# EAGLE design Lowduino_Minimal (EAGLE 7.2.0)
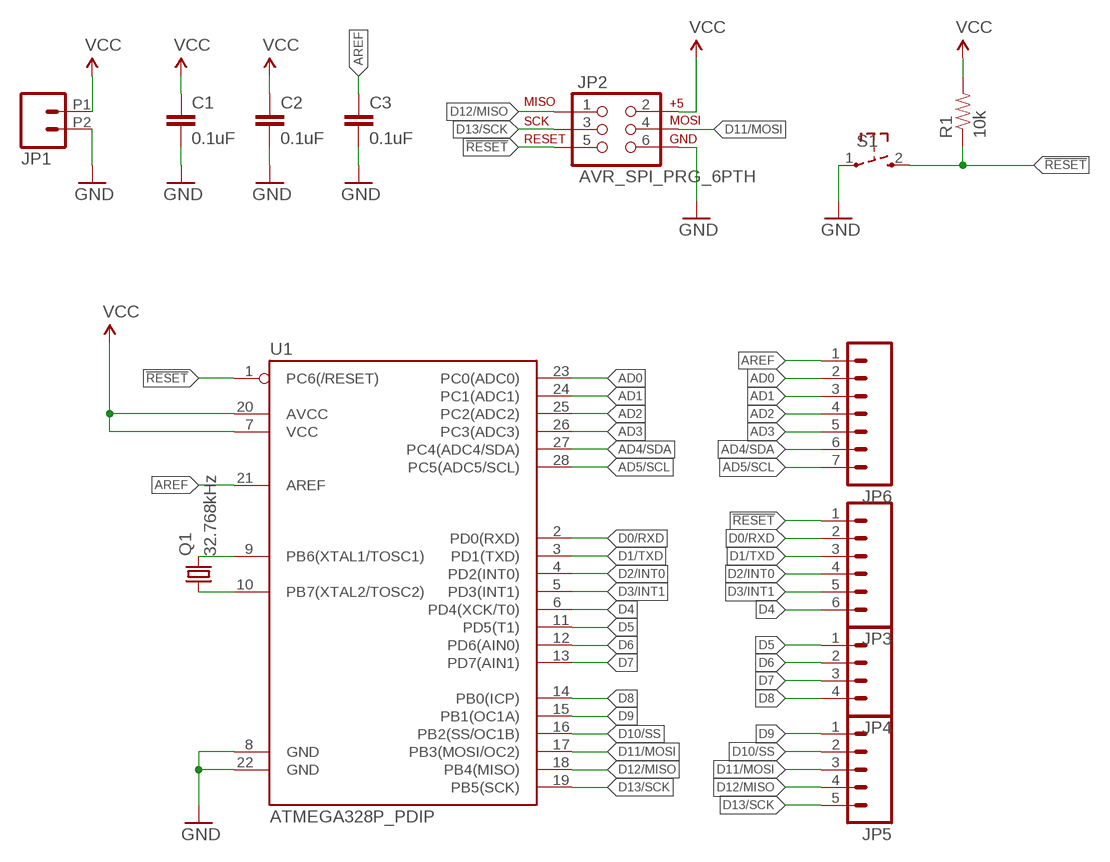
[diagram p0: schematic, sheet 1]

## Parts
C1  0.1uF  CAPPTH  [CAP-PTH-SMALL]
C2  0.1uF  CAPPTH  [CAP-PTH-SMALL]
C3  0.1uF  CAPPTH  [CAP-PTH-SMALL]
JP1  M022.54MM_SCREWTERM  [1X02_2.54_SCREWTERM]
JP2  AVR_SPI_PRG_6PTH  [2X3]
JP3  M06LOCK  [1X06_LOCK]
JP4  M04LOCK  [1X04_LOCK]
JP5  M05LOCK  [1X05_LOCK]
JP6  M07LOCK  [1X07_LOCK]
Q1  32.768kHz  CRYSTALTC26V  [TC26V]
R1  10k  10KOHM-1/4W5%(PTH)VERT  [AXIAL-0.1]
S1  MJTP_6MM  [MJTP1243]
U1  ATMEGA328P_PDIP  [DIL28-3]

## Nets
!RESET [ISP]: JP2.5 JP3.1 R1.P$1 S1.2 U1.1(PC6(/RESET))
AD0: JP6.2 U1.23(PC0(ADC0))
AD1: JP6.3 U1.24(PC1(ADC1))
AD2: JP6.4 U1.25(PC2(ADC2))
AD3: JP6.5 U1.26(PC3(ADC3))
AD4/SDA: JP6.6 U1.27(PC4(ADC4/SDA))
AD5/SCL: JP6.7 U1.28(PC5(ADC5/SCL))
AREF: C3.1 JP6.1 U1.21(AREF)
D0/RXD [close i/o]: JP3.2 U1.2(PD0(RXD))
D1/TXD [close i/o]: JP3.3 U1.3(PD1(TXD))
D2/INT0 [close i/o]: JP3.4 U1.4(PD2(INT0))
D3/INT1 [close i/o]: JP3.5 U1.5(PD3(INT1))
D4 [close i/o]: JP3.6 U1.6(PD4(XCK/T0))
D5 [close i/o]: JP4.1 U1.11(PD5(T1))
D6 [close i/o]: JP4.2 U1.12(PD6(AIN0))
D7 [close i/o]: JP4.3 U1.13(PD7(AIN1))
D8 [close i/o]: JP4.4 U1.14(PB0(ICP))
D9: JP5.1 U1.15(PB1(OC1A))
D10/SS: JP5.2 U1.16(PB2(SS/OC1B))
D11/MOSI [ISP]: JP2.4 JP5.3 U1.17(PB3(MOSI/OC2))
D12/MISO [ISP]: JP2.1 JP5.4 U1.18(PB4(MISO))
D13/SCK [ISP]: JP2.3 JP5.5 U1.19(PB5(SCK))
GND: C1.2 C2.2 C3.2 JP1.P2 JP2.6 S1.1 U1.8(GND) U1.22(GND)
VCC [power]: C1.1 C2.1 JP1.P1 JP2.2 R1.P$2 U1.7(VCC) U1.20(AVCC)
XTAL1: Q1.2 U1.9(PB6(XTAL1/TOSC1))
XTAL2: Q1.1 U1.10(PB7(XTAL2/TOSC2))

## Library data of the parts
C1-C3 = SparkFun-Capacitors:CAP: Capacitor Standard 0603 ceramic capacitor, and 0.1" leaded capacitor.
JP1 = SparkFun-Connectors:M02: Standard 2-pin 0.1" header. Use with - straight break away headers ( PRT-00116) - right angle break away headers (PRT-00553) - swiss pins (PRT-00743) - machine pins (PRT-00117) - female headers (PRT-00115) Molex polarized connector foot print use with: PRT-08233 with associated crimp pins and housings. 2.54_SCREWTERM for use with PRT-10571. 3.5mm Screw Terminal footprints for PRT-08084 5mm Screw Terminal footprints for use with PRT-08432
JP2 = SparkFun-Connectors:AVR_SPI_PRG_6: AVR ISP 6 Pin This is the reduced ISP connector for AVR programming. Common on Arduino. This footprint will take up less PCB space and can be used with a 10-pin to 6-pin adapter such as SKU: BOB-08508 **Special note about "TEST_POINT" package. The stop mask is on the top side, so if you want your programming test points to be on the bottom of your board, make sure to place this package on the bottom side of the board. This also ensure that the orientation to program from the bottom side will be correct.
JP3 = SparkFun-Connectors:M06: Header 6 Standard 6-pin 0.1" header. Use with straight break away headers (SKU : PRT-00116), right angle break away headers (PRT-00553), swiss pins (PRT-00743), machine pins (PRT-00117), and female headers (PRT-00115). Molex polarized connector foot print use with SKU : PRT-08094 with associated crimp pins and housings. NOTES ON THE VARIANTS LOCK and LOCK_LONGPADS... This footprint was designed to help hold the alignment of a through-hole component (i.e. 6-pin header) while soldering it into place. You may notice that each hole has been shifted either up or down by 0.005 of an inch from it's more standard position (which is a perfectly straight line). This slight alteration caused the pins (the squares in the middle) to touch the edges of the holes. Because they are alternating, it causes a "brace" to hold the component in place. 0.005 has proven to be the perfect amount of "off-center" position when using our standard breakaway headers. Although looks a little odd when you look at the bare footprint, once you have a header in there, the alteration is very hard to notice. Also,if you push a header all the way into place, it is covered up entirely on the bottom side. This idea of altering the position of holes to aid alignment will be further integrated into the Sparkfun Library for other footprints. It can help hold any component with 3 or more connection pins.
JP4 = SparkFun-Connectors:M04: Header 4 Standard 4-pin 0.1" header. Use with straight break away headers (SKU : PRT-00116), right angle break away headers (PRT-00553), swiss pins (PRT-00743), machine pins (PRT-00117), and female headers (PRT-00115). Molex polarized connector foot print use with SKU : PRT-08231 with associated crimp pins and housings. 1MM SMD Version SKU: PRT-10208
JP5 = SparkFun-Connectors:M05: Header 5 Standard 5-pin 0.1" header. Use with straight break away headers (SKU : PRT-00116), right angle break away headers (PRT-00553), swiss pins (PRT-00743), machine pins (PRT-00117), and female headers (PRT-00115). Molex polarized connector foot print use with SKU : PRT-08230 with associated crimp pins and housings.
JP6 = SparkFun-Connectors:M07: Header 7 Standard 7-pin 0.1" header. Use with straight break away headers (SKU : PRT-00116), right angle break away headers (PRT-00553), swiss pins (PRT-00743), machine pins (PRT-00117), and female headers (PRT-00115). NOTES ON THE VARIANTS LOCK and LOCK_LONGPADS... This footprint was designed to help hold the alignment of a through-hole component (i.e. 7-pin header) while soldering it into place. You may notice that each hole has been shifted either up or down by 0.005 of an inch from it's more standard position (which is usually a perfectly straight line). This slight alteration caused the pins (the squares in the middle) to touch the edges of the holes. Because they are alternating, it causes a "brace" to hold the header in place. 0.005 has proven to be the perfect amount of "off-center" position when using our standard breakaway headers. Although looks a little odd when you look at the bare footprint, once you have a header in there, the alteration is very hard to notice. Also, if you push a header all the way into place, it is covered up entirely on the bottom side. This idea of altering the position of holes to aid alignment will be further integrated into the Sparkfun Library for other footprints. It can help hold any component with 3 or more connection pins.
Q1 = adafruit:CRYSTAL: CRYSTAL; OC_FARNELL: unknown; OC_NEWARK: unknown
R1 = SparkFun-Resistors:10KOHM-1/4W5%(PTH): RES-09435; PROD_ID: RES-9435
S1 = Lowduino:MJTP_6MM
U1 = SparkFun-DigitalIC:ATMEGA328P_PDIP: uC used in the Arduino 32kb flash, 1k EEPROM, 2k SRAM This is the through-hole version of this chip.

## Net classes
1 power: width 1.27 mm
2 close i/o: width 1.27 mm
3 ISP: width 0.152 mm

## Board
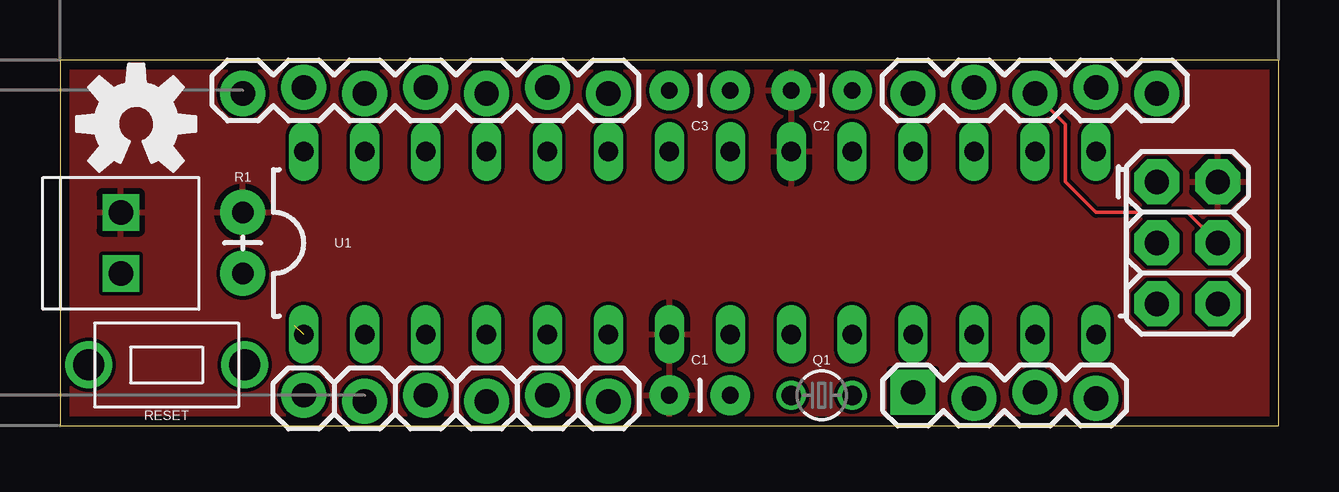
[diagram p1: board, top side]
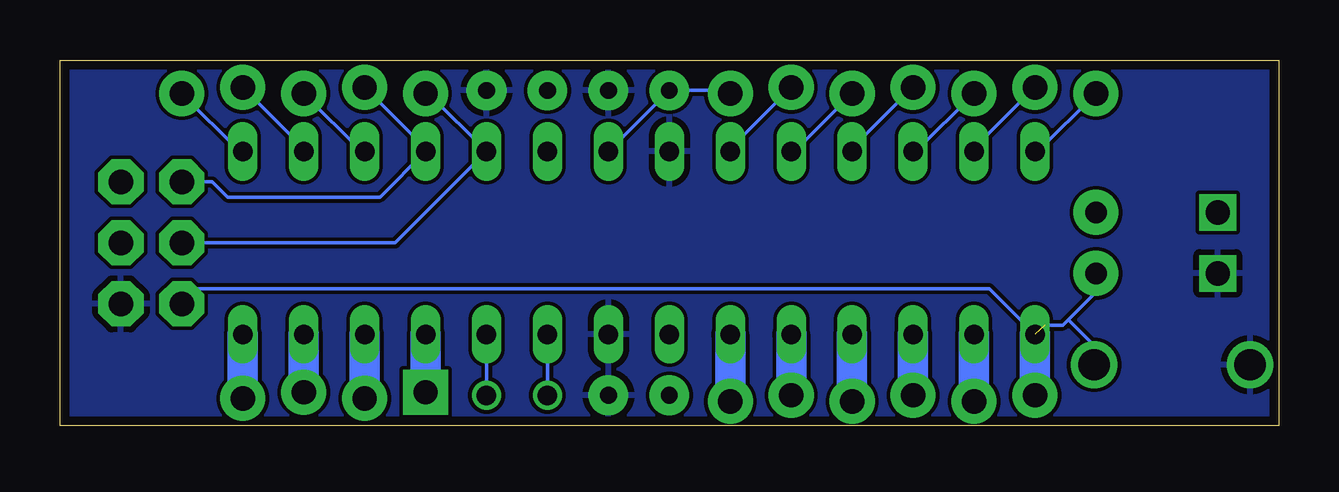
[diagram p2: board, bottom side, seen from below]

Size 50.8 x 15.24 mm. Coordinates in mm from the lower left corner, seen from the top.
Outline: 50.8,0 50.8,15.24 0,15.24 0,0 50.8,0
Copper layers (1*16): Top 0.0356mm / dielectric 1.5011mm / Bottom 0.0356mm
Design rules "oshpark-2layer": minimum track width 6mil, minimum drill 13mil, track to track 6mil, track to pad 6mil, pad to pad 6mil, via to via 6mil, smd to smd 6mil, copper to edge 15mil, drill to drill 6mil, minimum pad ring 7mil, minimum via ring 7mil, stop-mask expansion 4mil, vias tented up to drill 0mil, thermal gap 10mil

### Footprints (pad centres in the part's own frame; a part is rotated, then mirrored left to right if it is on the bottom)
CAP-PTH-SMALL = drill 0.7 pad 1.651: 1 0,0; 2 2.54,0
1X02_2.54_SCREWTERM = drill 1.016 square: P1 2.54,0; P2 0,0
2X3 = drill 1.016 pad 1.88 octagon: 1 0,0; 2 0,2.54; 3 2.54,0; 4 2.54,2.54; 5 5.08,0; 6 5.08,2.54
1X06_LOCK = drill 1.016 pad 1.88: 1 0,0; 2 2.54,-0.254; 3 5.08,0; 4 7.62,-0.254; 5 10.16,0; 6 12.7,-0.254
1X04_LOCK = drill 1.016 pad 1.88 square: 1 0,0.127 | drill 1.016 pad 1.88: 2 2.54,-0.127; 3 5.08,0.127; 4 7.62,-0.127
1X05_LOCK = drill 1.016 pad 1.88: 1 0,0.127; 2 2.54,-0.127; 3 5.08,0.127; 4 7.62,-0.127; 5 10.16,0.127
1X07_LOCK = drill 1.016 pad 1.88: 1 0,0.127; 2 2.54,-0.127; 3 5.08,0.127; 4 7.62,-0.127; 5 10.16,0.127; 6 12.7,-0.127; 7 15.24,0.127
TC26V = drill 0.813: 1 -1.27,0; 2 1.27,0
AXIAL-0.1 = drill 0.9 pad 1.88: P$1 0,0; P$2 2.54,0
MJTP1243 = drill 1.3: 1 -3.25,0; 2 3.25,0
DIL28-3 = drill 0.813 long: 1 -16.51,-3.81; 2 -13.97,-3.81; 3 -11.43,-3.81; 4 -8.89,-3.81; 5 -6.35,-3.81; 6 -3.81,-3.81; 7 -1.27,-3.81; 8 1.27,-3.81; 9 3.81,-3.81; 10 6.35,-3.81; 11 8.89,-3.81; 12 11.43,-3.81; 13 13.97,-3.81; 14 16.51,-3.81; 15 16.51,3.81; 16 13.97,3.81; 17 11.43,3.81; 18 8.89,3.81; 19 6.35,3.81; 20 3.81,3.81; 21 1.27,3.81; 22 -1.27,3.81; 23 -3.81,3.81; 24 -6.35,3.81; 25 -8.89,3.81; 26 -11.43,3.81; 27 -13.97,3.81; 28 -16.51,3.81

### Placement (x,y rotation side)
C1  25.4,1.27 0 top
C2  30.48,13.97 0 top
C3  25.4,13.97 0 top
JP1  2.54,6.35 90 top
JP2  45.72,10.16 270 top
JP3  10.16,1.27 0 top
JP4  35.56,1.27 0 top
JP5  45.72,13.97 180 top
JP6  22.86,13.97 180 top
Q1  31.75,1.27 180 top
R1  7.62,6.35 90 top
S1  4.45,2.54 0 top
U1  26.67,7.62 0 top
U$2  [OSHW-LOGO-M]  3.17,12.57 0 top

### Tracks (layer width: path | path; a pad name or v marks a point on that pad's centre or on a via)
!RESET  (1 unrouted)
  Bottom 0.152: R1.P$1 7.62,5.56 8.76,4.42 | 8.76,4.42 8.99,4.19 9.75,4.19 | 8.76,4.42 7.7,3.35 7.7,2.59 S1.2 | U1.1 12.06,5.71 45.09,5.71 JP2.5
  Bottom 1.27: U1.1 JP3.1
AD0
  Bottom 0.152: U1.23 22.86,11.56 JP6.2
AD1
  Bottom 0.152: U1.24 20.19,11.43 JP6.3
AD2
  Bottom 0.152: U1.25 17.78,11.56 JP6.4
AD3
  Bottom 0.152: U1.26 15.11,11.43 JP6.5
AD4/SDA
  Bottom 0.152: U1.27 12.7,11.56 JP6.6
AD5/SCL
  Bottom 0.152: U1.28 10.03,11.43 JP6.7
AREF
  Bottom 0.152: U1.21 C3.1 22.99,13.97 JP6.1
D0/RXD
  Bottom 1.27: U1.2 JP3.2
D1/TXD
  Bottom 1.27: U1.3 JP3.3
D2/INT0
  Bottom 1.27: U1.4 JP3.4
D3/INT1
  Bottom 1.27: U1.5 JP3.5
D4
  Bottom 1.27: U1.6 JP3.6
D5
  Bottom 1.27: U1.11 JP4.1
D6
  Bottom 1.27: U1.12 JP4.2
D7
  Bottom 1.27: U1.13 JP4.3
D8
  Bottom 1.27: U1.14 JP4.4
D9
  Bottom 0.152: U1.15 43.31,11.43 JP5.1
D10/SS
  Bottom 0.152: U1.16 40.64,11.56 JP5.2
D11/MOSI
  Top 0.152: JP2.4 46.99,8.89 43.18,8.89 41.91,10.16 41.91,12.57 JP5.3
  Bottom 0.152: U1.17 38.23,11.43 JP5.3
D12/MISO
  Bottom 0.152: 35.59,11.43 U1.18 | JP2.1 44.45,10.16 43.81,9.53 37.47,9.53 U1.18 | U1.18 35.56,11.56 JP5.4
D13/SCK
  Bottom 0.152: JP5.5 35.43,13.84 U1.19 36.83,7.62 JP2.3
GND
  pour Bottom: 50.8,0 50.8,15.24 0,15.24 0,0
VCC
  pour Top: 50.8,0 50.8,15.24 0,15.24 0,0
XTAL1
  Bottom 0.152: U1.9 Q1.2
XTAL2
  Bottom 0.152: U1.10 Q1.1

### Text on the board
tNames: RESET